# EasyEDA schematic SCH_POTY_2026-03-09.json
TITLE: Sheet_1; REV: 1.0; Date: 2026-03-02; Sheet: 1/1; Drawn By: wowczik; Company: Your Company
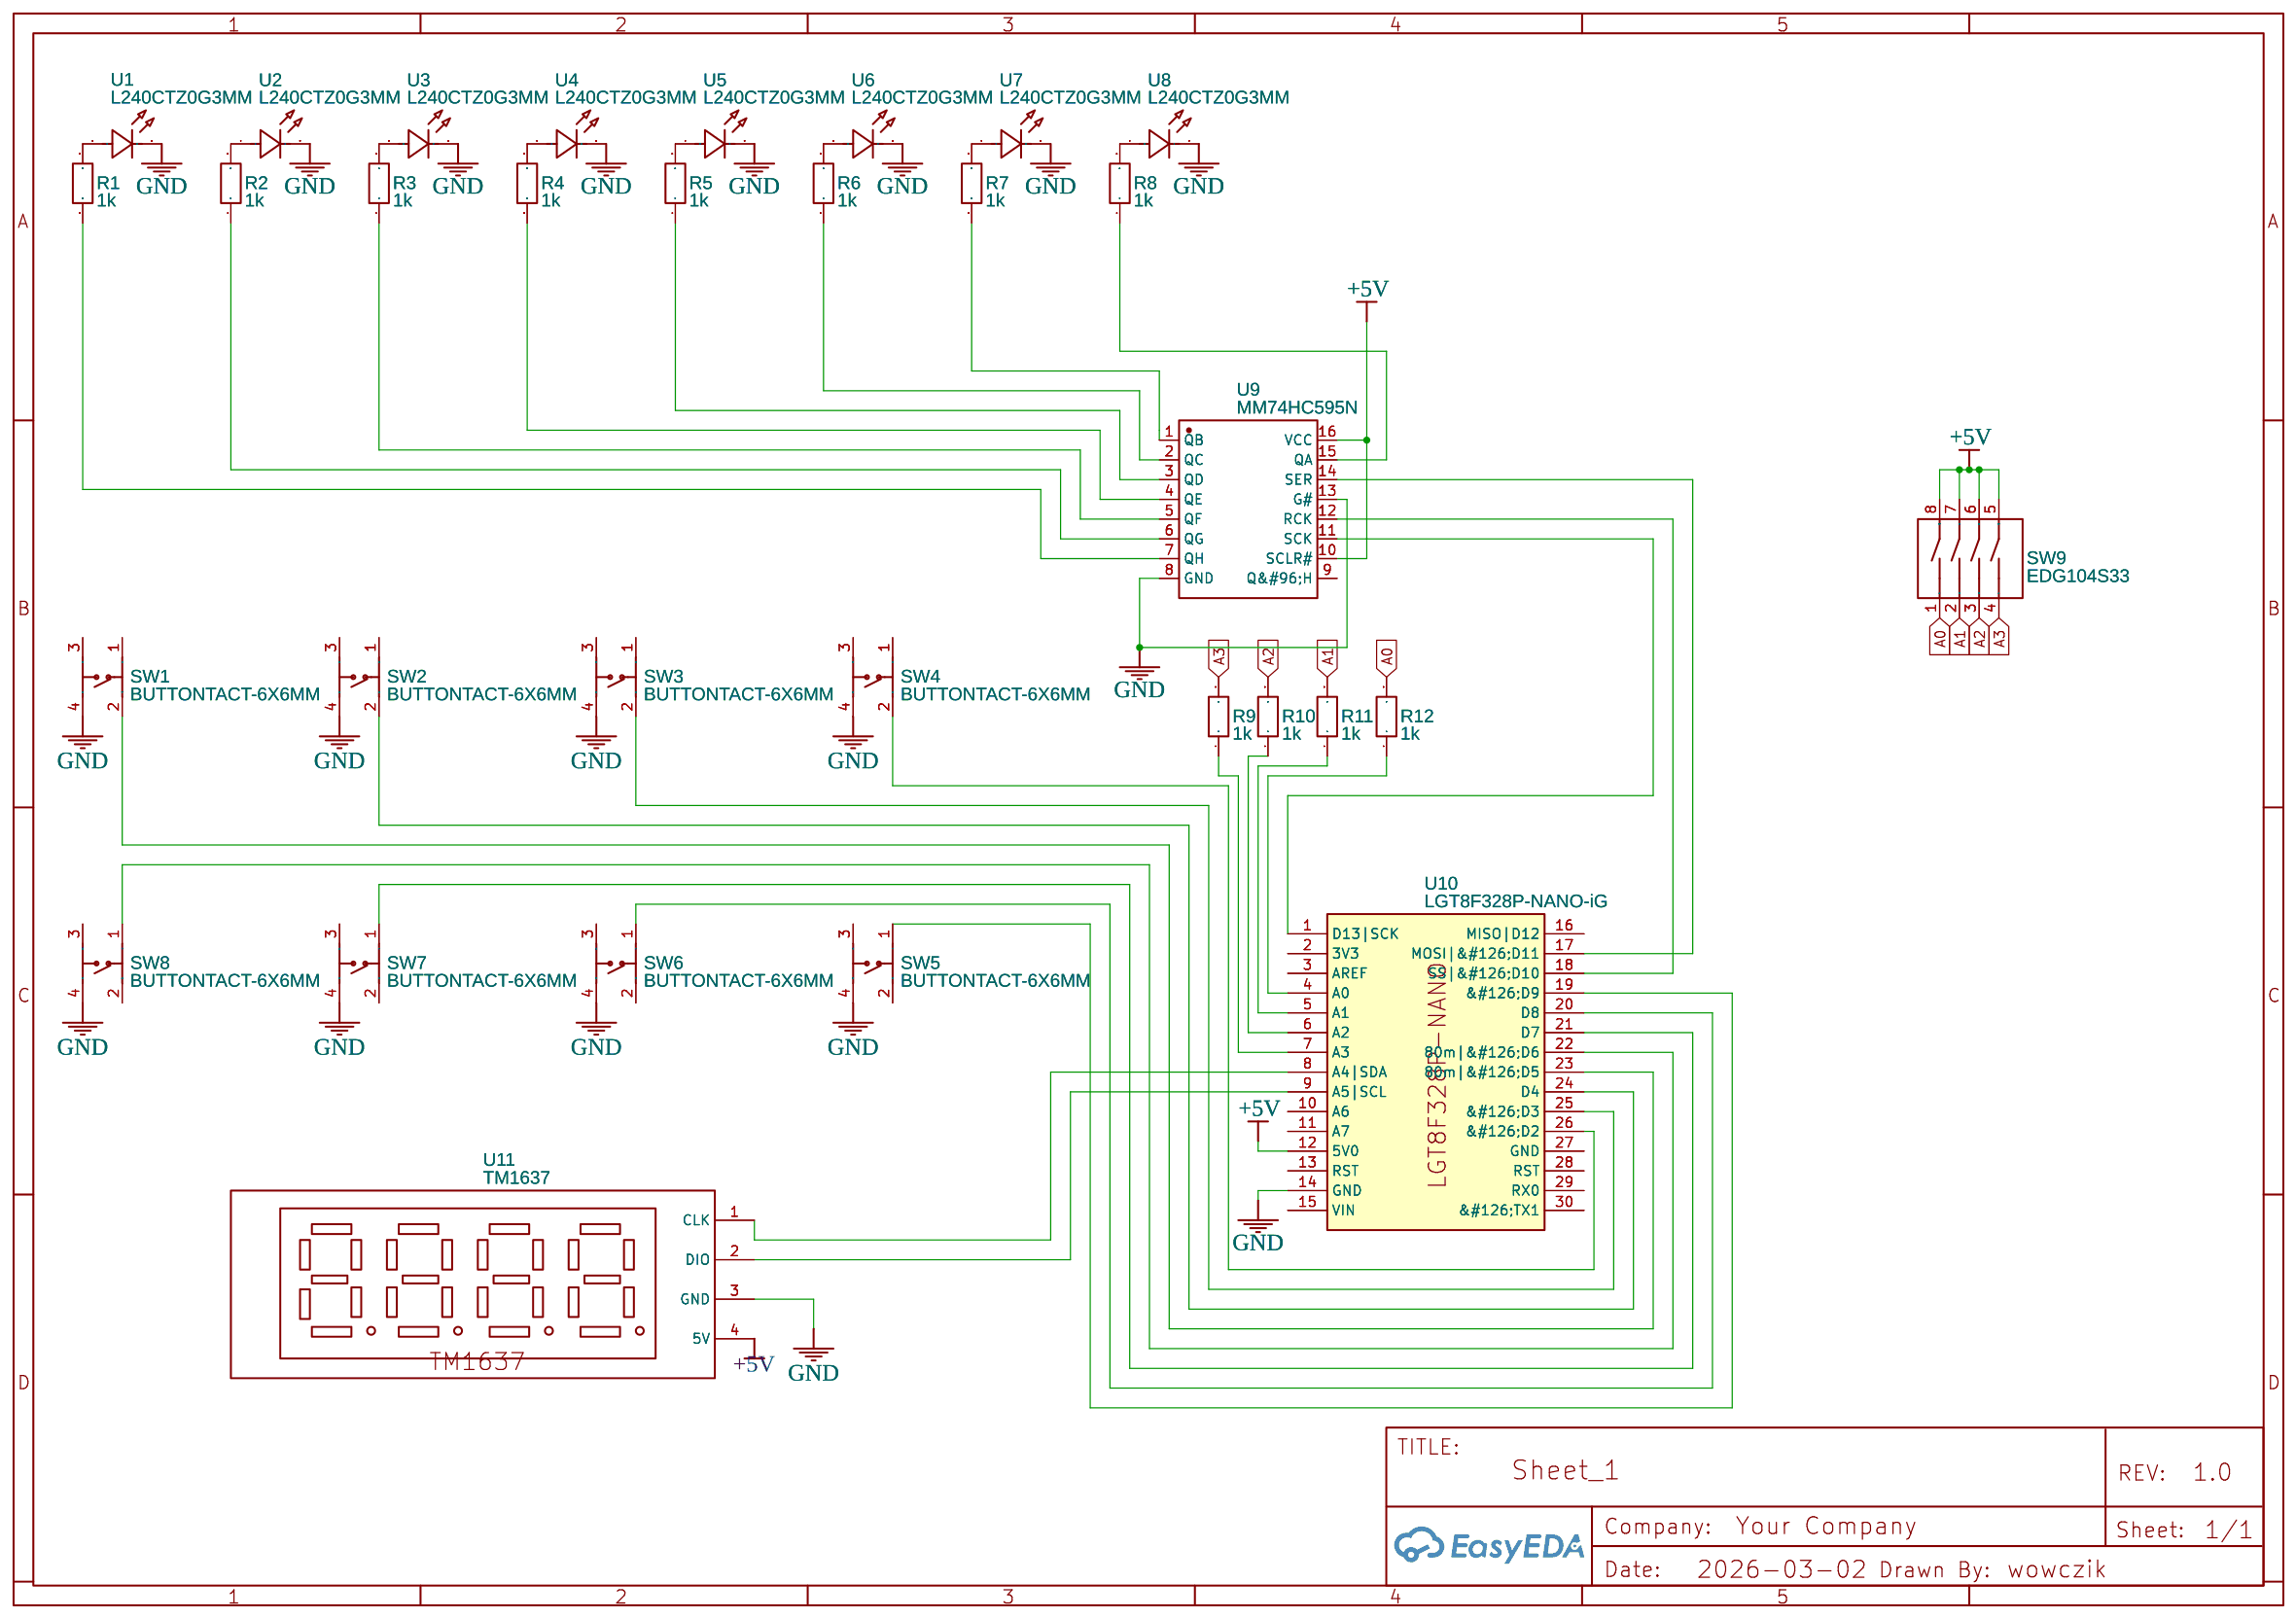
[diagram p0: schematic sheet]

## Parts
R1  1k  [R_AXIAL-0.3]
R2  1k  [R_AXIAL-0.3]
R3  1k  [R_AXIAL-0.3]
R4  1k  [R_AXIAL-0.3]
R5  1k  [R_AXIAL-0.3]
R6  1k  [R_AXIAL-0.3]
R7  1k  [R_AXIAL-0.3]
R8  1k  [R_AXIAL-0.3]
R9  1k  [R0603]
R10  1k  [R0603]
R11  1k  [R0603]
R12  1k  [R0603]
SW1  BUTTONTACT-6X6MM  [SW-SMD_4P-L6.0-W6.0-P4.50-LS9.2]
SW2  BUTTONTACT-6X6MM  [SW-SMD_4P-L6.0-W6.0-P4.50-LS9.2]
SW3  BUTTONTACT-6X6MM  [SW-SMD_4P-L6.0-W6.0-P4.50-LS9.2]
SW4  BUTTONTACT-6X6MM  [SW-SMD_4P-L6.0-W6.0-P4.50-LS9.2]
SW5  BUTTONTACT-6X6MM  [SW-SMD_4P-L6.0-W6.0-P4.50-LS9.2]
SW6  BUTTONTACT-6X6MM  [SW-SMD_4P-L6.0-W6.0-P4.50-LS9.2]
SW7  BUTTONTACT-6X6MM  [SW-SMD_4P-L6.0-W6.0-P4.50-LS9.2]
SW8  BUTTONTACT-6X6MM  [SW-SMD_4P-L6.0-W6.0-P4.50-LS9.2]
SW9  EDG104S33  [SW-TH_8P-L11.7-W9.7-P2.54-LS7.6-BL]
U1  L240CTZ0G3MM  [LED-TH_BD3.8-P2.54_L240CTZ0G3MM]
U2  L240CTZ0G3MM  [LED-TH_BD3.8-P2.54_L240CTZ0G3MM]
U3  L240CTZ0G3MM  [LED-TH_BD3.8-P2.54_L240CTZ0G3MM]
U4  L240CTZ0G3MM  [LED-TH_BD3.8-P2.54_L240CTZ0G3MM]
U5  L240CTZ0G3MM  [LED-TH_BD3.8-P2.54_L240CTZ0G3MM]
U6  L240CTZ0G3MM  [LED-TH_BD3.8-P2.54_L240CTZ0G3MM]
U7  L240CTZ0G3MM  [LED-TH_BD3.8-P2.54_L240CTZ0G3MM]
U8  L240CTZ0G3MM  [LED-TH_BD3.8-P2.54_L240CTZ0G3MM]
U9  MM74HC595N  [PDIP-16_L19.7-W6.6-P2.54-LS7.6-BL]
U10  LGT8F328P-NANO-iG  [LGT8F328P-NANO-IG]
U11  TM1637  [4DIGITS-TM1637]

## Library data of the parts
R1-R8 = R_AXIAL-0.3_EU: Contributor: LCEDA_Lib
R9-R12 = R_0603_EU: Contributor: LCEDA_Lib
SW1-SW8 = BUTTONTACT-6X6MM: Contributor: LCSC; Supplier: LCSC; Supplier Part: C9900004221; Manufacturer Part: Buttontact-6x6mm; Manufacturer: null; JLCPCB Part Class: Extended Part
SW9 = EDG104S33: Supplier: LCSC; Supplier Part: C840579; Manufacturer: ECE(百容); JLCPCB Part Class: Extended Part; Contributor: lcsc
U1-U8 = L240CTZ0G3MM: Supplier: LCSC; Supplier Part: C9900093286; Manufacturer: null; Contributor: lcsc; JLCPCB Part Class: Extended Part
U9 = MM74HC595N: Contributor: lcsc; Supplier: LCSC; Supplier Part: C3304019; Manufacturer: onsemi(安森美); JLCPCB Part Class: Extended Part
U10 = LGT8F328P-NANO-iG: Supplier: Solartech; Contributor: igrozavescu
U11 = TM1637: Contributor: sensorhost

## Nets
+5V: SW9.5 SW9.6 SW9.7 SW9.8 U9.10(SCLR#) U9.16(VCC) U10.12(5V0) U11.4(5V)
GND: SW1.4(D) SW2.4(D) SW3.4(D) SW4.4(D) SW5.4(D) SW6.4(D) SW7.4(D) SW8.4(D) U1.2(K) U2.2(K) U3.2(K) U4.2(K) U5.2(K) U6.2(K) U7.2(K) U8.2(K) U9.8(GND) U9.13(G#) U10.14(GND) U11.3(GND)
A0: R12.2 SW9.1
A1: R11.2 SW9.2
A2: R10.2 SW9.3
A3: R9.2 SW9.4
Net-(R1-1): R1.1 U9.7(QH)
Net-(R1-2): R1.2 U1.1(A)
Net-(R2-1): R2.1 U9.6(QG)
Net-(R2-2): R2.2 U2.1(A)
Net-(R3-1): R3.1 U9.5(QF)
Net-(R3-2): R3.2 U3.1(A)
Net-(R4-1): R4.1 U9.4(QE)
Net-(R4-2): R4.2 U4.1(A)
Net-(R5-1): R5.1 U9.3(QD)
Net-(R5-2): R5.2 U5.1(A)
Net-(R6-1): R6.1 U9.2(QC)
Net-(R6-2): R6.2 U6.1(A)
Net-(R7-1): R7.1 U9.1(QB)
Net-(R7-2): R7.2 U7.1(A)
Net-(R8-1): R8.1 U9.15(QA)
Net-(R8-2): R8.2 U8.1(A)
Net-(R9-1): R9.1 U10.7(A3)
Net-(R10-1): R10.1 U10.6(A2)
Net-(R11-1): R11.1 U10.5(A1)
Net-(R12-1): R12.1 U10.4(A0)
Net-(SW1-2): SW1.2(B) U10.23(80m|&#126;D5)
Net-(SW2-2): SW2.2(B) U10.24(D4)
Net-(SW3-2): SW3.2(B) U10.25(&#126;D3)
Net-(SW4-2): SW4.2(B) U10.26(&#126;D2)
Net-(SW5-1): SW5.1(A) U10.19(&#126;D9)
Net-(SW6-1): SW6.1(A) U10.20(D8)
Net-(SW7-1): SW7.1(A) U10.21(D7)
Net-(SW8-1): SW8.1(A) U10.22(80m|&#126;D6)
Net-(U9-11): U9.11(SCK) U10.1(D13|SCK)
Net-(U9-12): U9.12(RCK) U10.18(SS|&#126;D10)
Net-(U9-14): U9.14(SER) U10.17(MOSI|&#126;D11)
Net-(U10-8): U10.8(A4|SDA) U11.1(CLK)
Net-(U10-9): U10.9(A5|SCL) U11.2(DIO)

Not connected (* = marked no-connect by the designer): SW1 1(A) 3(C); SW2 1(A) 3(C); SW3 1(A) 3(C); SW4 1(A) 3(C); SW5 2(B) 3(C); SW6 2(B) 3(C); SW7 2(B) 3(C); SW8 2(B) 3(C); U9 9(Q&#96;H); U10 2(3V3) 3(AREF) 10(A6) 11(A7) 13(RST) 15(VIN) 16(MISO|D12) 27(GND) 28(RST) 29(RX0) 30(&#126;TX1)
